# Altium schematic sheet Driver.SchDoc
size A3
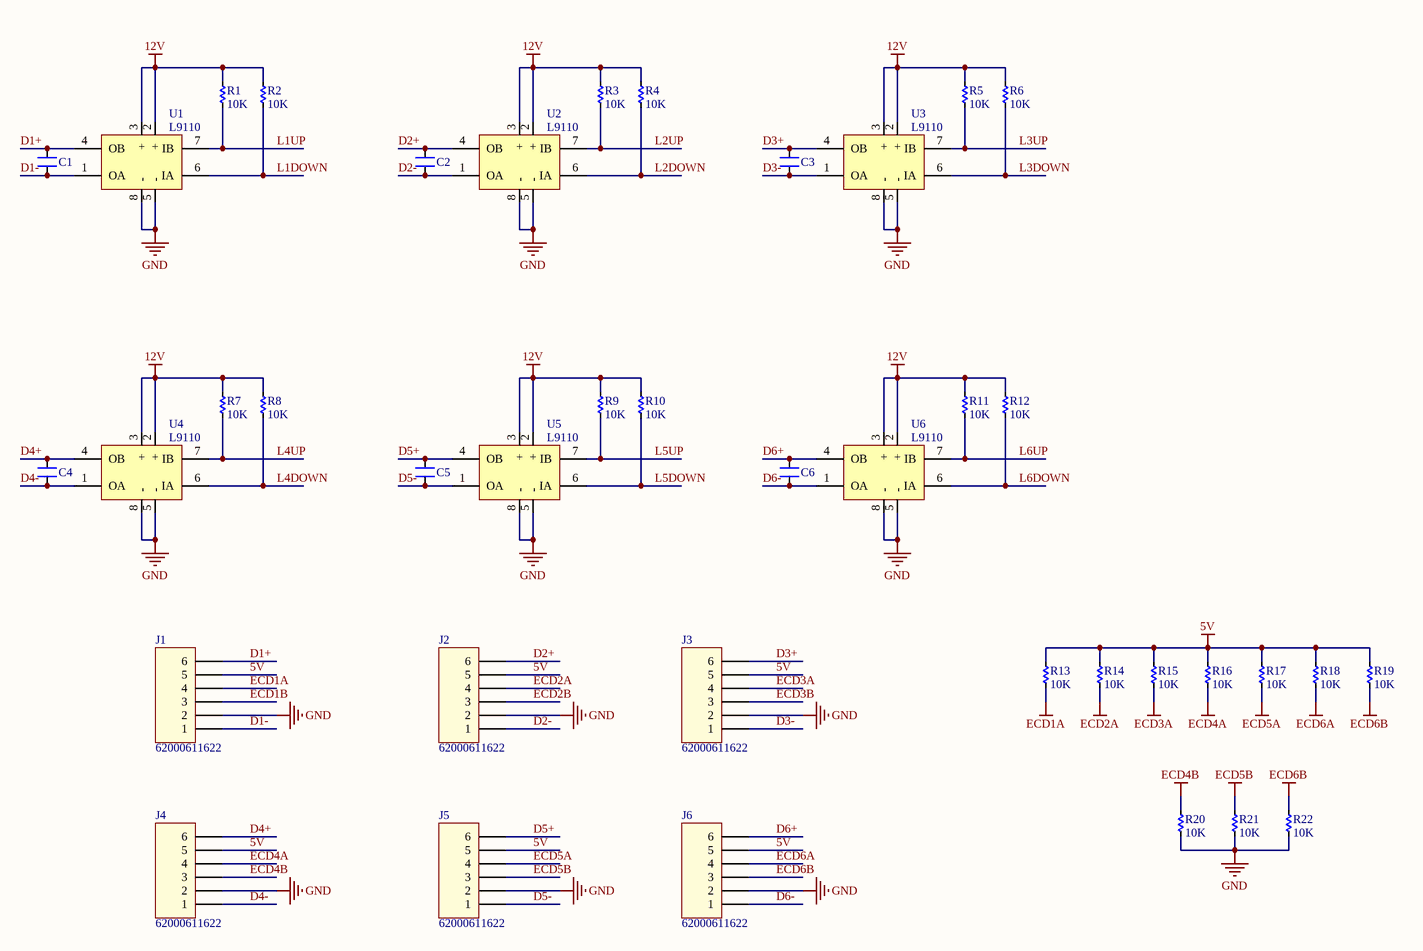
[diagram p0: Driver.SchDoc]

## Parts
C1  XXpF  [CN2-LT]  (value not drawn)
C2  XXpF  [CN2-LT]  (value not drawn)
C3  XXpF  [CN2-LT]  (value not drawn)
C4  XXpF  [CN2-LT]  (value not drawn)
C5  XXpF  [CN2-LT]  (value not drawn)
C6  XXpF  [CN2-LT]  (value not drawn)
J1  62000611622  [62000611622]
J2  62000611622  [62000611622]
J3  62000611622  [62000611622]
J4  62000611622  [62000611622]
J5  62000611622  [62000611622]
J6  62000611622  [62000611622]
R1  10K  [RES-SMD-0805]
R2  10K  [RES-SMD-0805]
R3  10K  [RES-SMD-0805]
R4  10K  [RES-SMD-0805]
R5  10K  [RES-SMD-0805]
R6  10K  [RES-SMD-0805]
R7  10K  [RES-SMD-0805]
R8  10K  [RES-SMD-0805]
R9  10K  [RES-SMD-0805]
R10  10K  [RES-SMD-0805]
R11  10K  [RES-SMD-0805]
R12  10K  [RES-SMD-0805]
R13  10K  [RES-SMD-0805]
R14  10K  [RES-SMD-0805]
R15  10K  [RES-SMD-0805]
R16  10K  [RES-SMD-0805]
R17  10K  [RES-SMD-0805]
R18  10K  [RES-SMD-0805]
R19  10K  [RES-SMD-0805]
R20  10K  [RES-SMD-0805]
R21  10K  [RES-SMD-0805]
R22  10K  [RES-SMD-0805]
U1  L9110  [DIP8]
U2  L9110  [DIP8]
U3  L9110  [DIP8]
U4  L9110  [DIP8]
U5  L9110  [DIP8]
U6  L9110  [DIP8]

## Nets
5V: J1.5 J2.5 J3.5 J4.5 J5.5 J6.5 R13.1 R14.1 R15.1 R16.1 R17.1 R18.1 R19.1
12V: R1.1 R2.1 R3.1 R4.1 R5.1 R6.1 R7.1 R8.1 R9.1 R10.1 R11.1 R12.1 U1.2(+) U1.3(+) U2.2(+) U2.3(+) U3.2(+) U3.3(+) U4.2(+) U4.3(+) U5.2(+) U5.3(+) U6.2(+) U6.3(+)
ECD1A: J1.4 R13.2
ECD2A: J2.4 R14.2
ECD3A: J3.4 R15.2
ECD4A: J4.4 R16.2
ECD4B: J4.3 R20.2
ECD5A: J5.4 R17.2
ECD5B: J5.3 R21.2
ECD6A: J6.4 R18.2
ECD6B: J6.3 R19.2 R22.2
GND: J1.2 J2.2 J3.2 J4.2 J5.2 J6.2 R20.1 R21.1 R22.1 U1.5(-) U1.8(-) U2.5(-) U2.8(-) U3.5(-) U3.8(-) U4.5(-) U4.8(-) U5.5(-) U5.8(-) U6.5(-) U6.8(-)
D1+: C1.2 J1.6 U1.4(OB)
D1-: C1.1 J1.1 U1.1(OA)
D2+: C2.2 J2.6 U2.4(OB)
D2-: C2.1 J2.1 U2.1(OA)
D3+: C3.2 J3.6 U3.4(OB)
D3-: C3.1 J3.1 U3.1(OA)
D4+: C4.2 J4.6 U4.4(OB)
D4-: C4.1 J4.1 U4.1(OA)
D5+: C5.2 J5.6 U5.4(OB)
D5-: C5.1 J5.1 U5.1(OA)
D6+: C6.2 J6.6 U6.4(OB)
D6-: C6.1 J6.1 U6.1(OA)
ECD1B: J1.3
ECD2B: J2.3
ECD3B: J3.3
L1DOWN: R2.2 U1.6(IA)
L1UP: R1.2 U1.7(IB)
L2DOWN: R4.2 U2.6(IA)
L2UP: R3.2 U2.7(IB)
L3DOWN: R6.2 U3.6(IA)
L3UP: R5.2 U3.7(IB)
L4DOWN: R8.2 U4.6(IA)
L4UP: R7.2 U4.7(IB)
L5DOWN: R10.2 U5.6(IA)
L5UP: R9.2 U5.7(IB)
L6DOWN: R12.2 U6.6(IA)
L6UP: R11.2 U6.7(IB)

## Library data of the parts
C1-C6 = CN: Value: 33pF
J1-J6 = 62000611622: WR-WTB 2.00mm Male Vertical Shrouded Header, 6p; Pin Number: 6; ComponentLink1Description: Manufacturer; ComponentLink1URL: http://www.we-online.de; ComponentLink2Description: Datasheet; ComponentLink2URL: http://katalog.we-online.de/em/datasheet/6200xx11622.pdf; Part Number: 62000611622; Published Date: June 2017; Publisher: Wurth Elektronik; Pitch: 2.00 mm
R1-R22 = Res-SMD: Resistor; Manufacturer: Generic Components; Class: Passive; Published: 08/06/2000; Publisher: Altium Hobart Technology Centre
U1-U6 = L9110: Half-Bridge Driver